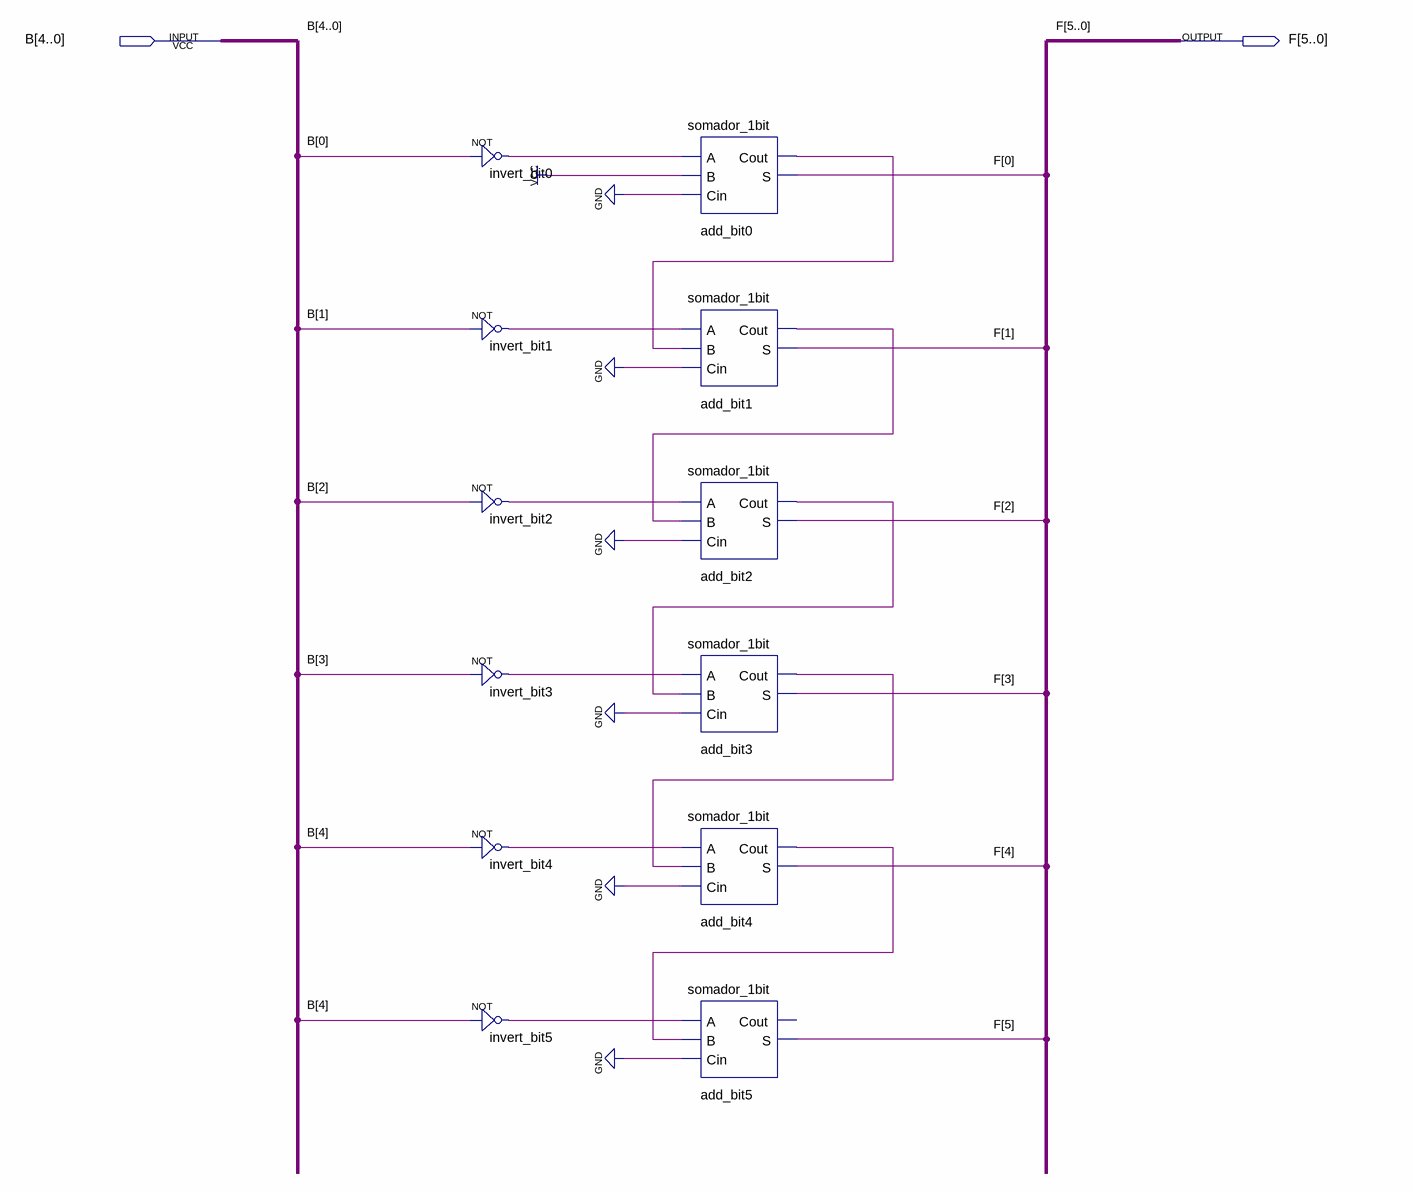
[diagram p0: schematic sheet]
// Quartus schematic Complemento_2.bdf as structural Verilog: 12 symbols, 2 pins
module Complemento_2 (
  input  [4:0] B,
  output [5:0] F
);

  wire add_bit0_cout, add_bit1_cout, add_bit2_cout, add_bit3_cout, add_bit4_cout, invert_bit0_out,
       invert_bit1_out, invert_bit2_out, invert_bit3_out, invert_bit4_out, invert_bit5_out;

  not invert_bit0 (invert_bit0_out, B[0]);
  not invert_bit1 (invert_bit1_out, B[1]);
  not invert_bit2 (invert_bit2_out, B[2]);
  not invert_bit3 (invert_bit3_out, B[3]);
  not invert_bit4 (invert_bit4_out, B[4]);
  not invert_bit5 (invert_bit5_out, B[4]);
  somador_1bit add_bit0 (.A(invert_bit0_out), .B(1'b1), .Cin(1'b0), .Cout(add_bit0_cout), .S(F[0]));
  somador_1bit add_bit1 (.A(invert_bit1_out), .B(add_bit0_cout), .Cin(1'b0), .Cout(add_bit1_cout), .S(F[1]));
  somador_1bit add_bit2 (.A(invert_bit2_out), .B(add_bit1_cout), .Cin(1'b0), .Cout(add_bit2_cout), .S(F[2]));
  somador_1bit add_bit3 (.A(invert_bit3_out), .B(add_bit2_cout), .Cin(1'b0), .Cout(add_bit3_cout), .S(F[3]));
  somador_1bit add_bit4 (.A(invert_bit4_out), .B(add_bit3_cout), .Cin(1'b0), .Cout(add_bit4_cout), .S(F[4]));
  somador_1bit add_bit5 (.A(invert_bit5_out), .B(add_bit4_cout), .Cin(1'b0), .S(F[5]));  // open: Cout
endmodule
